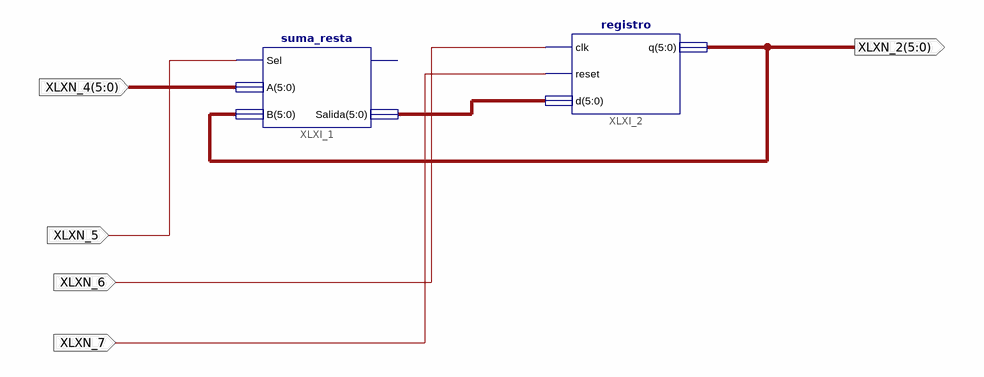
[diagram p0: schematic sheet 1]
// Xilinx ISE schematic Acumulador.sch (spartan6) as structural Verilog: 2 symbols, 5 ports
module Acumulador (
  input  [5:0] XLXN_4,
  input  XLXN_5,
  input  XLXN_6,
  input  XLXN_7,
  output [5:0] XLXN_2
);

  wire [5:0] XLXN_1;

  suma_resta XLXI_1 (.Sel(XLXN_5), .A(XLXN_4), .B(XLXN_2), .Salida(XLXN_1));  // open: Cout
  registro XLXI_2 (.clk(XLXN_6), .reset(XLXN_7), .d(XLXN_1), .q(XLXN_2));
endmodule
